# Altium schematic sheet fonte.SchDoc: Fonte
size A3; Address1: UFCG; Address2: Laboratório VIRTUS CC; Address3: Campina Grande, PB - Brasil; SheetNumber: 3; SheetTotal: 8; Project: HAT RPi 4 - Phase Shifter Fotônico; DocumentRev: 01; SCH_SCALE: N/A; Version: v1.0
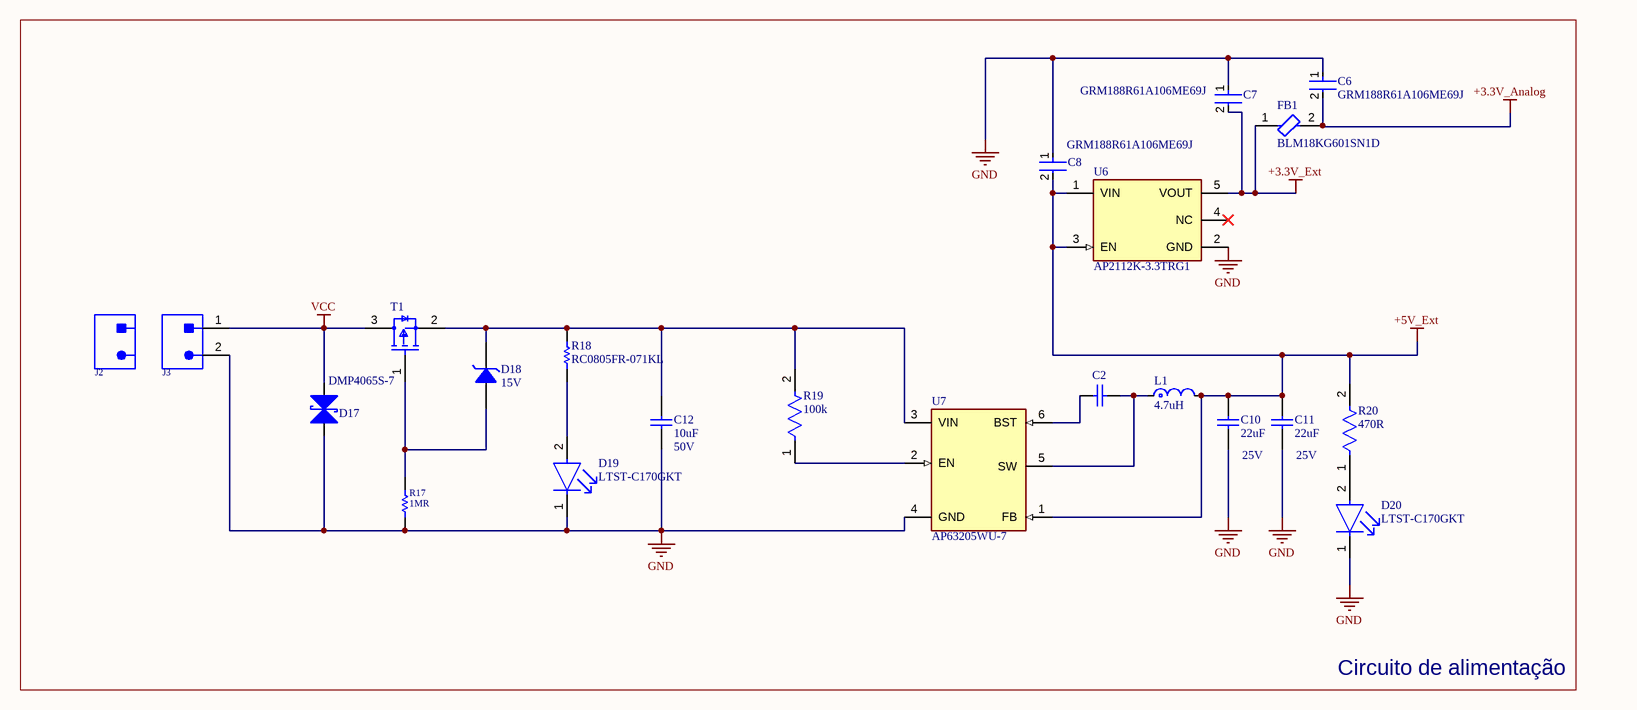
[diagram p0: fonte.SchDoc]

## Parts
C2  VJ0603Y104MXJCW1BC  [CAPC1608X95X40NL15T15]  (value not drawn)
C6  GRM188R61A106ME69J  [FP-GRM188-0_15-IPC_C]
C7  GRM188R61A106ME69J  [FP-GRM188-0_15-IPC_C]
C8  GRM188R61A106ME69J  [FP-GRM188-0_15-IPC_C]
C10  value 22uF  Voltage Rating (DC): 25V  [C-0805]  (hidden comment: CL21A226MAYNNNE)
C11  value 22uF  Voltage Rating: 25V  [C-0805]  (hidden comment: CL21A226MAYNNNE)
C12  value 10uF  Voltage Rating (DC): 50V  [C-1206]  (hidden comment: CL31A106KBHNNNE)
D17  SMBJ28CAQ-13-F  [DO-214AA]  (value not drawn)
D18  Zener Voltage: 15V  [SOD-123]  (hidden comment: MMSZ5245B-TP)
D19  LTST-C170GKT  [FP-LTST-C170GKT-MFG]
D20  LTST-C170GKT  [FP-LTST-C170GKT-MFG]
FB1  BLM18KG601SN1D  [FP-BLM18-0_15-t0_8-IPC_A]
J2  5447861  [5447861]  (value not drawn)
J3  5444262  [5444262]  (value not drawn)
L1  value 4.7uH  [FP-DG6045C-MFG]  (hidden comment: 1255AY-4R7M=P3)
R17  value 1MR  [R-0805]  (hidden comment: RC0805FR-071ML)
R18  RC0805FR-071KL  [RESC2013X60X35ML10T20]
R19  100k  [FP-CRGCQ0805-IPC_C]
R20  470R  [FP-CRGCQ0805-IPC_C]
T1  DMP4065S-7  [FP-SOT23-MFG]
U6  AP2112K-3.3TRG1  [FP-SOT25-IPC_A]
U7  AP63205WU-7  [TSOT-23-6_A]

## Blocks framed on the sheet
Circuito de alimentação: C2 C6-C8 C10-C12 D17-D20 FB1 J2 J3 L1 R17-R20 T1 U6 U7

## Nets
+3.3V_Analog: C6.2 FB1.2
+3.3V_Ext: C7.2 FB1.1 U6.5(VOUT)
+5V_Ext: C8.2 C10.1 C11.1 L1.2 R20.2 U6.1(VIN) U6.3(EN) U7.1(FB)
GND: C6.1 C7.1 C8.1 C10.2 C11.2 C12.2 D17.2(Anode) D19.1(C) D20.1(C) J3.2 R17.1 U6.2(GND) U7.4(GND)
VCC: D17.1(Cathode) J3.1 T1.3(D)
NetC2_1: C2.1 U7.6(BST)
NetC2_2: C2.2 L1.1 U7.5(SW)
NetC12_1: C12.1 D18.1(K) R18.2 R19.2 T1.2(S) U7.3(VIN)
NetD18_2: D18.2(A) R17.2 T1.1(G)
NetD19_2: D19.2(A) R18.1
NetD20_2: D20.2(A) R20.1
NetR19_1: R19.1 U7.2(EN)

Not connected (* = marked no-connect by the designer): U6 4(NC)*

## Notes on the sheet
- REVISION
- DESCRIPTION
- DATE
- APPROVED
- ADDRESS
- PROJECT
- VERSION
- TITLE
- A3
- SIZE
- SCALE
- DOCUMENT NAME:
- DOCUMENT REVISION:
- OF
- SHEET:
- PROJECT REVISION:

## Library data of the parts
C2 = CMP-2006-00058-1: Manufacturer: Vitramon; Part Number: VJ0603Y104MXJCW1BC
C6-C8 = CMP-06035-033844-1: Chip Multilayer Ceramic Capacitors for General Purpose, 0603, 10uF, X5R, 15%, 20%, 10V; Dielectric: X5R; Thickness: 800um; Tolerance: 20%; Length: 1.6mm; Voltage Rating (DC): 10V; Width: 800um; Capacitance: 10uF
C10 C11 = CL21A226MAYNNNE: CAP CER 22UF 25V X5R 0805; Manufacturer: Samsung; Material: 4241ConductorMaterial; Tolerance: 20%; Supplier: Digikey; Supplier Part Number: 1276-CL21A226MAYNNNECT-ND; Manufacturer Part Number: CL21A226MAYNNNE; RoHS: Yes; Category: Ceramic Capacitors; Stock: 120266; Pricing: 1=0,11, 10=0,066, 50=0,044, 100=0,043 (USD); Case/Package: 0805; Min Operating Temperature: -55°C; Max Operating Temperature: 85°C; Dielectric: X5R; Height: 1.45mm; RoHS Compliant: Yes; ComponentLink1URL: https://datasheet.octopart.com/CL21A226MAYNNNE-Samsung-Electro-Mechanics-datasheet-149154243.pdf?src-supplier=Future+Electronics; ComponentLink1Description: https://datasheet.octopart.com/CL21A226MAYNNNE-Samsung-Electro-Mechanics-datasheet-149154243.pdf?src-supplier=Future+Electronics; ComponentLink2URL: https://datasheet.octopart.com/CL21A226MAYNNNE-Samsung-datasheet-8326407.pdf?src-supplier=TME; ComponentLink2Description: https://datasheet.octopart.com/CL21A226MAYNNNE-Samsung-datasheet-8326407.pdf?src-supplier=TME; Supplier 1: Mouser; Supplier Part Number 1: 187-CL21A226MAYNNNE; Supplier 2: Digikey; Supplier Part Number 2: 1276-CL21A226MAYNNNECT-ND
  C10: Voltage Rating: 25V
  C11: Voltage Rating (DC): 25V
C12 = CL31A106KBHNNNE: CAP CER 10UF 50V X5R 1206; Manufacturer: Samsung; Material: Ceramic; Tolerance: 10%; Supplier: Digikey; Supplier Part Number: 1276-2876-1-ND; Manufacturer Part Number: CL31A106KBHNNNE; RoHS: Yes; Category: Ceramic Capacitors; Stock: 133875; Pricing: 1=0,11, 10=0,07 (USD); Mounting Technology: Surface Mount; Case/Package: 1206; Case Code (Metric): 3216; Case Code (Imperial): 1206; Min Operating Temperature: -55°C; Max Operating Temperature: 85°C; Package Quantity: 1; Packaging: Tape and Reel; Voltage Rating: 50V; Dielectric: X5R; Series: CL; Construction: Flat; Length: 3.2mm; Width: 0.063inch; Height: 1.6mm; Thickness: 0.071inch; Depth: 1.6mm; Radiation Hardening: No; Lead Free: Lead Free; RoHS Compliant: Yes; ComponentLink1URL: https://datasheet.ciiva.com/25726/cl31a106kbhnnne-25726404.pdf?src-supplier=Digikey; ComponentLink1Description: https://datasheet.ciiva.com/25726/cl31a106kbhnnne-25726404.pdf?src-supplier=Digikey; ComponentLink2URL: https://datasheet.ciiva.com/15216/getdatasheetpartid-353196-15216238.pdf?src-supplier=Verical; ComponentLink2Description: https://datasheet.ciiva.com/15216/getdatasheetpartid-353196-15216238.pdf?src-supplier=Verical; ComponentLink3URL: https://datasheet.ciiva.com/29201/452492-da-01-en-vs-kondensator-1206-29201107.pdf?src-supplier=Conrad; ComponentLink3Description: https://datasheet.ciiva.com/29201/452492-da-01-en-vs-kondensator-1206-29201107.pdf?src-supplier=Conrad; ComponentLink4URL: https://datasheet.ciiva.com/16437/cl05b104kq5nnnc-16437222.pdf?src-supplier=Future+Electronics; ComponentLink4Description: https://datasheet.ciiva.com/16437/cl05b104kq5nnnc-16437222.pdf?src-supplier=Future+Electronics; Supplier 1: Mouser; Supplier Part Number 1: 187-CL31A106KBHNNNE; Supplier 2: Digikey; Supplier Part Number 2: 1276-2876-2-ND
D17 = SMBJ28CAQ-13-F: TVS DIODE 28VWM 45.4VC SMB; Manufacturer: Diodes; Number of Bidirectional Channels: 1; Reverse Standoff Voltage: 28V; Min Breakdown Voltage: 31.1V; Clamping Voltage: 45.4V; Peak Pulse Current: 13.2A; Peak Pulse Power: 600W; Power Line Protection: No; Supplier 1: Digi-Key; Manufacturer Part Number: SMBJ28CAQ-13-F; RoHS: Yes; Category: TVS Diodes; Stock 1: 16278; Pricing 1: 1=0,44000, 10=0,37900, 100=0,28310, 500=0,22240, 1000=0,17185 (USD); Mount: Surface Mount; Case/Package: SMB; Min Operating Temperature: -55°C; Max Operating Temperature: 150°C; Resistor Type: Zener; Packaging: Tape and Reel; RoHS Compliant: Yes; ComponentLink1URL: https://www.diodes.com/assets/Datasheets/ds40740.pdf?src-supplier=Digi-Key; ComponentLink1Description: https://www.diodes.com/assets/Datasheets/ds40740.pdf?src-supplier=Digi-Key; Supplier 2: Mouser; Supplier Part Number 2: 621-SMBJ28CAQ-13-F; Supplier Part Number 1: SMBJ28CAQ-13-FDICT-ND
D18 = MMSZ5245B-TP: DIODE ZENER 15V 500MW SOD123; Manufacturer: MCC; Tolerance: 5%; Impedance: 16R; Max Reverse Leakage Current: 100nA; Test Current: 8.5mA; Element Configuration: Single; Supplier 1: Digi-Key; Manufacturer Part Number: MMSZ5245B-TP; RoHS: Yes; Category: Zener Diodes; Stock 1: 330368; Pricing 1: 1=0,22000, 10=0,17700, 100=0,09400, 500=0,06188, 1000=0,04208 (USD); Mount: Surface Mount; Number of Pins: 2; Min Operating Temperature: -55°C; Max Operating Temperature: 150°C; Packaging: Tape and Reel; Package Quantity: 1; Max Power Dissipation: 500mW; Power Dissipation: 500mW; Voltage Tolerance: 5%; Series: -; Lead Free: Lead Free; ComponentLink1URL: https://datasheet.ciiva.com/890/mmsz5221-mmsz5259sod123-890445.pdf?src-supplier=Digi-Key; ComponentLink1Description: https://datasheet.ciiva.com/890/mmsz5221-mmsz5259sod123-890445.pdf?src-supplier=Digi-Key; ComponentLink2URL: https://datasheet.ciiva.com/890/mmsz5221-mmsz5259sod123-890446.pdf?src-supplier=Digi-Key; ComponentLink2Description: https://datasheet.ciiva.com/890/mmsz5221-mmsz5259sod123-890446.pdf?src-supplier=Digi-Key; ComponentLink3URL: https://datasheet.ciiva.com/890/mmsz5221-mmsz5259sod123-890447.pdf?src-supplier=Digi-Key; ComponentLink3Description: https://datasheet.ciiva.com/890/mmsz5221-mmsz5259sod123-890447.pdf?src-supplier=Digi-Key; Supplier 2: Mouser; Supplier 3: Arrow Electronics; Supplier Part Number 1: MMSZ5245B-TPMSCT-ND; Supplier Part Number 2: 833-MMSZ5245B-TP; Supplier Part Number 3: MMSZ5245B-TP
D19 D20 = CMP-1674-00002-6: LED GREEN CLEAR SMD; Dominant Wavelength: 569nm; Lens Style: Diffused; Forward Voltage: 2.1V; Number of Elements: 1; Wavelength: 565nm; Luminous Intensity: 6mcd; Test Current: 10mA; Power Dissipation: 100mW; Reverse Voltage: 5V; Forward Current: 30mA; Viewing Angle: 130°; Lens Color: Colorless; Min Operating Temperature: -55°C; Number of Pins: 2; Max Operating Temperature: 85°C; Color: Green; Radiation Hardening: No; Illumination Color: Green; Case Code (Metric): 2012; Lens Transparency: Clear; Case/Package: 0805; Width: 1.25mm; Case Code (Imperial): 0805; Package Quantity: 1; Height: 1.1mm; Depth: 1.25mm; Length: 2mm; Power Rating: 100mW; Lead Free: Lead Free; Number of LEDs: 1; Packaging: Tape and Reel; Mount: Surface Mount; Voltage: 5V
FB1 = CMP-0686-00581-3: Chip Ferrite Bead, 0603, 600Ω @ 100MHz, 0.15Ω, 25%, 1.3A; Material: Steel; Number of Lines: 1; Impedance: 600R; DC Resistance (DCR): 150mR; Tolerance: 25%; Case Code (Metric): 1608; Width: 0.8mm; DC Current: 1.3A; Max DC Current: 1.3A; Package Quantity: 1; Number of Pins: 2; Military Standard: Not; RoHS Compliant: Yes; Termination: SMD/SMT; Max Operating Temperature: 125°C; Length: 1.6mm; Depth: 0.8mm; Case Code (Imperial): 0603; Series: BLM18K; Inductor Type: FERRITE BEAD; Core Material: Ferrite; Number of Circuits: 1; Height: 0.8mm; Case/Package: 0603; REACH SVHC: No SVHC; Packaging: Tape and Reel; Min Operating Temperature: -55°C; Max Current Rating: 1.3A; Radiation Hardening: No; Current Rating: 1.3A; Lead Free: Lead Free; Test Frequency: 100MHz; Weight: 7.1E-05oz
J2 = 5447861: TERM BLOCK PLUG 2POS STR 3.81MM; Manufacturer: Phoenix Contact; Current Rating: 8A; Voltage Rating: 160V; Number of Positions: 2; Number of Levels: 1; Connector Type: Screw; Voltage: 300V; Wire Gauge (Max): 30AWG; Wire Gauge (Min): 14AWG; Pitch: 0.15inch; Supplier 1: Digi-Key; Manufacturer Part Number: 5447861; RoHS: Yes; Category: Terminal Blocks; Stock 1: 30203; Pricing 1: 1=2,56000, 10=2,45300, 50=2,38620, 100=2,23000, 250=2,05160, 500=1,89550, 1000=1,80631, 2500=1,77954 (USD); Mount: Free Hanging; Number of Pins: 2; Color: Green; Contact Plating: Tin; Housing Material: Polyamide; Package Quantity: 100; Packaging: Bulk; Number of Positions Per Level: 2; Termination: Screw; Current: 8A; Flammability Rating: UL94 V-0; ComponentLink1URL: https://datasheet.ciiva.com/29706/5447861-29706032.pdf?src-supplier=Digi-Key; ComponentLink1Description: https://datasheet.ciiva.com/29706/5447861-29706032.pdf?src-supplier=Digi-Key; Supplier 2: Mouser; Supplier Part Number 1: 277-11343-ND; Supplier Part Number 2: 651-5447861; JLCPCB Part: *
J3 = 5444262: TERM BLOCK HDR 2POS 90DEG 3.81MM; Manufacturer: Phoenix Contact; Current Rating: 8A; Voltage Rating: 160V; Number of Positions: 2; Number of Levels: 1; Voltage: 300V; Pitch: 0.15inch; Supplier 1: Digi-Key; Manufacturer Part Number: 5444262; RoHS: Yes; Category: Terminal Blocks; Stock 1: 66186; Pricing 1: 1=0,87000, 10=0,83600, 50=0,81320, 100=0,76000, 250=0,69920, 500=0,64600, 1000=0,61560, 2500=0,60648 (USD); Mount: Through Hole; Contact Plating: Tin; Color: Green; Housing Material: Polyamide; Packaging: Bulk; Termination: Solder; Package Quantity: 100; Number of Positions Per Level: 2; Current: 8A; Length: 9.2mm; RoHS Compliant: Yes; Flammability Rating: UL94 V-0; ComponentLink1URL: https://datasheet.ciiva.com/29682/5444262-29682658.pdf?src-supplier=Digi-Key; ComponentLink1Description: https://datasheet.ciiva.com/29682/5444262-29682658.pdf?src-supplier=Digi-Key; Supplier 2: Mouser; Supplier Part Number 2: 651-5444262; Supplier Part Number 1: 277-11313-ND; JLCPCB Part: *
L1 = 1255AY-4R7M=P3: FIXED IND 4.7UH 4A 23 MOHM SMD; Manufacturer: Murata; Core Material: Ferrite; Current Rating: 4.5A; Shielding: Shielded; DC Resistance (DCR): 27.6mR; Test Frequency: 100kHz; Tolerance: 20%; Supplier: Digikey; Supplier Part Number: 490-10812-1-ND; Manufacturer Part Number: 1255AY-4R7M=P3; RoHS: Yes; Category: Fixed Inductors; Stock: 84053; Pricing: 1=0,38, 10=0,314, 100=0,2584 (USD); Mounting Technology: Surface Mount; Case/Package: Nonstandard; Min Operating Temperature: -40°C; Max Operating Temperature: 85°C; Packaging: Cut Tape; Series: DG6045C; Inductance Tolerance: 20%; RMS Current (Irms): 4A; ESR: 27.6mR; Length: 0.248inch; Width: 0.248inch; Height: 4.5mm; Height - Seated (Max): 0.177inch; RoHS Compliant: Yes; ComponentLink1URL: http://search.murata.co.jp/Ceramy/image/img/P02/J(E)TE243B-0037_DG6045C_reference.pdf?src-supplier=Digikey; ComponentLink1Description: http://search.murata.co.jp/Ceramy/image/img/P02/J(E)TE243B-0037_DG6045C_reference.pdf?src-supplier=Digikey; ComponentLink2URL: http://www.toko.co.jp/products/pdf/inductors/dg6045c.pdf?src-supplier=Digikey; ComponentLink2Description: http://www.toko.co.jp/products/pdf/inductors/dg6045c.pdf?src-supplier=Digikey; ComponentLink3URL: http://www.toko.co.jp/products/pdf/inductors/dg6045c.pdf?src-supplier=Avnet; ComponentLink3Description: http://www.toko.co.jp/products/pdf/inductors/dg6045c.pdf?src-supplier=Avnet; Saturation Current: 4.5A
R17 = RC0805FR-071ML: RES 1M OHM 1% 1/8W 0805; Manufacturer: Yageo; Voltage Rating: 150V; Power Rating: 125mW; Temperature Coefficient: 250ppm/°C; Supplier: Digikey; Supplier Part Number: 311-1.00MCRCT-ND; Manufacturer Part Number: RC0805FR-071ML; RoHS: Yes; Category: Chip SMD Resistors; Stock: 145027; Pricing: 1=0,1, 10=0,026, 50=0,0162, 100=0,0134, 500=0,00906, 1000=0,00778 (USD); Case/Package: Molded; Case Code (Imperial): 0805; Case Code (Metric): 2012; Min Operating Temperature: -55°C; Max Operating Temperature: 155°C; Packaging: Tape and Reel; Tolerance: 1%; Resistor Type: Thick Film; Construction: Rectangular; Resistance Tolerance: 1%; Voltage Rating (AC): 150V; Length: 2mm; Depth: 1.25mm; RoHS Compliant: Yes; Reach SVHC Compliant: Unknown; Military Standard: Not; Lead Free: Lead Free; Supplier 1: Digikey; Supplier Part Number 1: 311-1.00MCRCT-ND; Supplier 2: Mouser; Supplier Part Number 2: 603-RC0805FR-071ML; ComponentLink1URL: https://datasheet.ciiva.com/17419/rc0805-17419909.pdf?src-supplier=Future+Electronics; ComponentLink1Description: https://datasheet.ciiva.com/17419/rc0805-17419909.pdf?src-supplier=Future+Electronics
R18 = CMP-2100-03671-1: Chip Resistor, 1 KOhm, +/- 1%, 125 mW, -55 to 155 degC, 0805 (2012 Metric), RoHS, Tape and Reel; Manufacturer: Yageo; Temperature Coefficient: 100ppm/degreesC; Voltage Rating (DC): 150V; Max Power Dissipation: 125mW; Resistance: 1KOhm; Number of Pins: 2; Number of Terminations: 2; Datasheet URL: http://www.yageo.com/NewPortal/yageodocoutput?fileName=/pdf/R-Chip/PYu-RC_Group_51_RoHS_L_5.pdf; Length: 0.079inch; Package Description: 2-Pin Surface Mounted Device, Body 2 x 1.25 mm; Depth: 1.25mm; Height: 0.024inch; Military Standard: Not; Case/Package: 0805; Package Reference: 0805; RoHSCompliant: true; Lead Free: LeadFree; Packaging: TapeandReel; Package Quantity: 1; Datasheet Version: Rev. 5, 10/2016; Tolerance: 1%; Min Operating Temperature: -55degC; Voltage Rating: 150V; Composition: ThickFilm; Case Code (Imperial): 0805; Power Rating: 125mW; Width: 0.049inch; Case Code (Metric): 2012; Manufacturer URL: http://www.yageo.com/; Max Operating Temperature: 155degC; REACH SVHC: Unknown; Termination: SMD/SMT
R19 = CMP-03211-000816-1: CRGCQ 0805 100K 1%; Manufacturer: TE Connectivity; Manufacturer Part Number: CRGCQ0805F100K; Tolerance: 0.01; Power Rating: 0.125W; Resistance: 100KΩ; Value: 100KΩ; Temperature Coefficient: ±100ppm/°C; Voltage Rating: 150V; RoHS: TRUE; ComponentLink2URL: https://www.te.com/commerce/DocumentDelivery/DDEController?Action=showdoc&DocId=Data+Sheet%7F1773204-3%7F1%7Fpdf%7FEnglish%7FENG_DS_1773204-3_1.pdf%7F4-2176341-1150; Category: Res; Device Class L2: Resistors; Height: 0.65mm; Ambient Temperature Range High: +70°C; Ipc Land Pattern Name: RESC200125X55; Octopart: https://octopart.com/crgcq0805f100k-te+connectivity-91018138; Digikey Description: CRGCQ 0805 100K 1%; Temperature Range High: +155°C; Lead Free: Yes; Automotive: Yes; Temperature Range Low: -55°C; Device Class L1: Passive Components; Device Class L3: Chip SMD Resistors; Mouser Description: Res Thick Film 0805 100K Ohm 1% 0.125W(1/8W) ±100ppm/C Pad SMD Automotive T/R; Temperature: -55°C to +155°C; Composition: Thick Film; ComponentLink2Description: Datasheet; Automotive Grade: Grade 1141; Package: CRGCQ0805; Series: CRGCQ
R20 = CMP-03211-002267-1: CRGCQ0805 470Ω 0.125W ±100ppm/°C 5% 150V; Manufacturer: TE Connectivity; Manufacturer Part Number: CRGCQ0805J470R; Tolerance: 0.05; Automotive Grade: Grade 610; Temperature Range Low: -55°C; Power Rating: 0.125W; Temperature: -55°C to +155°C; Height: 0.65mm; Temperature Coefficient: ±100ppm/°C; Resistance: 470Ω; Composition: Thick Film; Ambient Temperature Range High: +70°C; Category: Res; Value: 470Ω; Automotive: Yes; Series: CRGCQ; Package: CRGCQ0805; Device Class L3: Chip SMD Resistors; ComponentLink2URL: https://www.te.com/commerce/DocumentDelivery/DDEController?Action=showdoc&DocId=Data+Sheet%7F1773204-3%7F1%7Fpdf%7FEnglish%7FENG_DS_1773204-3_1.pdf%7F4-2176341-619; Device Class L2: Resistors; Octopart: https://octopart.com/crgcq0805j470r-te+connectivity-91018229; Voltage Rating: 150V; Ipc Land Pattern Name: RESC200125X55; Temperature Range High: +155°C; Device Class L1: Passive Components; ComponentLink2Description: Datasheet; RoHS: TRUE; Lead Free: Yes
T1 = CMP-12801-000050-1: MOSFET P-CH 40V 2.4A SOT23; Manufacturer: Diodes Inc.; Number Of Channels: 1; Max Junction Temp: +150°C; Standoff Height: 0.013mm; Power Dissipation: 0.72W; Turn Off Delay Time: 36.3ns; Rthja Max: 171°C/W; Typ Forward Diode Voltage: -0.7V; Max Forward Diode Voltage: -1.2V; Drain To Source Voltage: -40V; Threshold Vgs Min: -1V; Gate To Source Voltage: 20V; Depletion Mode: False; Input Capacitace At Vds: 587pF @ -20V; Drain To Source Resistance: 64mΩ; Turn On Delay Time: 3.6ns; Continuous Drain Current: -2.4A; Pulse Drain Current: -20A; Gate Charge At Vgs: 12.2nC @ -10V; Threshold Vgs Max: -3V; Octopart: https://octopart.com/dmp4065s-7-diodes+inc.-57605044; Footprint Url: https://www.diodes.com/assets/Package-Files/SOT23.pdf; Device Class L2: Transistors; Package: SOT23; Number Of P Channels: 1; ComponentLink2URL: https://www.diodes.com/assets/Datasheets/DMP4065S.pdf; Temperature Range High: +150°C; Device Class L1: Discrete Semiconductors; Temperature Range Low: -55°C; Manufacturer Part Number: DMP4065S-7; ComponentLink2Description: Datasheet; Lead Free: Yes; Temperature: -55°C to +150°C; Drain To Source Breakdown Voltage: -40V; Category: Trans; Height: 1.1mm; Digikey Description: MOSFET P-CH 40V 2.4A SOT23; Ipc Land Pattern Name: SOT92P240X102-3; Device Class L3: MOSFETs; RoHS: TRUE; Mouser Description: Trans MOSFET P-CH 40V 2.4A Automotive 3-Pin SOT-23 T/R; Automotive: No
U6 = CMP-12756-000035-1: IC REG LINEAR 3.3V 600MA SOT25; Number of Regulators: 1; Output Type: Fixed; Polarity: Positive; Min Input Voltage: 2.5V; Max Input Voltage: 6V; Accuracy: 1.5%; Quiescent Current: 55uA; Dropout Voltage: 250mV; Min Operating Temperature: -40°C; Length: 3.1mm; Output Current: 600mA; Max Operating Temperature: 85°C; Package Quantity: 1; Output Voltage: 3.3V; Width: 1.7mm; Number of Outputs: 1; Packaging: Tape and Reel; Height: 1.3mm; Lead Free: Lead Free; Max Output Current: 600mA; Case/Package: SOT-23-5; Mount: Surface Mount; Number of Pins: 5
U7 = AP63205WU-7: IC REG BUCK 5V 2A TSOT23-6; Manufacturer: Diodes; Max Duty Cycle: 100%; Max Supply Voltage: 32V; Min Supply Voltage: 3.8V; Nominal Supply Current: 22uA; Number of Outputs: 1; Switching Frequency: 1.1MHz; Supplier: Digikey; Supplier Part Number: AP63205WU-7DICT-ND; Manufacturer Part Number: AP63205WU-7; RoHS: Yes; Category: Voltage Regulators - Switching; Stock: 6143; Pricing: 1=0,71, 10=0,506, 25=0,4548, 100=0,398, 250=0,37088, 500=0,35456, 1000=0,34112 (USD); Min Operating Temperature: -40°C; Max Operating Temperature: 85°C; Output Current: 2A; Output Voltage: 5V; Height: 1mm; ComponentLink1URL: https://www.diodes.com/assets/Datasheets/AP63200-AP63201-AP63203-AP63205.pdf?src-supplier=Digikey; ComponentLink1Description: https://www.diodes.com/assets/Datasheets/AP63200-AP63201-AP63203-AP63205.pdf?src-supplier=Digikey; Supplier 1: Digikey; Supplier Part Number 1: AP63205WU-7DICT-ND; Supplier 2: Mouser; Supplier Part Number 2: 621-AP63205WU-7